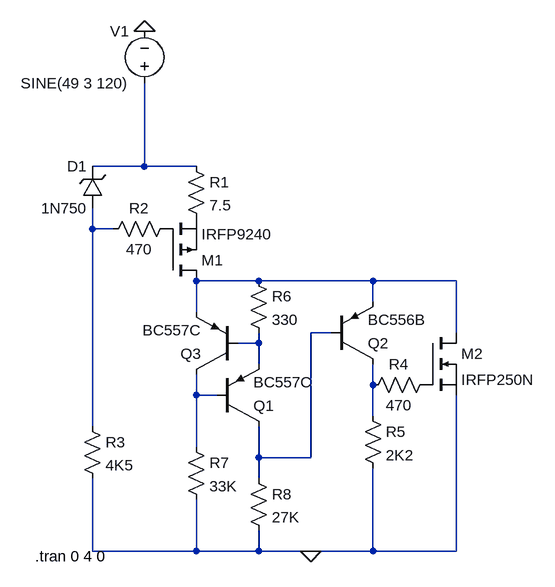
[diagram p0: schematic SALASSHUNTHV.asc]
SALASSHUNTHV.asc, the LTspice schematic file:
Version 4
SHEET 1 1072 680
WIRE 112 -16 112 -144
WIRE 112 -16 32 -16
WIRE 192 -16 112 -16
WIRE 32 80 32 48
WIRE 64 80 32 80
WIRE 288 160 192 160
WIRE 464 160 288 160
WIRE 512 160 464 160
WIRE 592 160 512 160
WIRE 464 192 464 160
WIRE 192 208 192 160
WIRE 400 240 368 240
WIRE 592 240 592 160
WIRE 288 256 288 240
WIRE 288 256 256 256
WIRE 288 288 288 256
WIRE 464 320 464 288
WIRE 192 336 192 304
WIRE 224 336 192 336
WIRE 464 368 464 320
WIRE 32 384 32 80
WIRE 192 416 192 336
WIRE 288 432 288 384
WIRE 368 432 368 240
WIRE 368 432 288 432
WIRE 288 464 288 432
WIRE 32 576 32 464
WIRE 192 576 192 496
WIRE 192 576 32 576
WIRE 288 576 288 544
WIRE 288 576 192 576
WIRE 368 576 288 576
WIRE 464 576 464 448
WIRE 464 576 368 576
WIRE 592 576 592 336
WIRE 592 576 464 576
FLAG 112 -224 0
FLAG 368 576 0
DATAFLAG 512 160 ""
SYMBOL pmos 144 160 M180
SYMATTR InstName M1
SYMATTR Value IRFP9240
SYMBOL res 176 -32 R0
SYMATTR InstName R1
SYMATTR Value 7.5
SYMBOL zener 48 48 R180
WINDOW 0 24 64 Left 2
WINDOW 3 24 0 Left 2
SYMATTR InstName D1
SYMATTR Value 1N750
SYMBOL res 160 64 R90
WINDOW 0 0 56 VBottom 2
WINDOW 3 32 56 VTop 2
SYMATTR InstName R2
SYMATTR Value 470
SYMBOL voltage 112 -128 R180
WINDOW 0 24 96 Left 2
WINDOW 3 24 16 Left 2
WINDOW 123 0 0 Left 2
WINDOW 39 0 0 Left 2
SYMATTR InstName V1
SYMATTR Value SINE(49 3 120)
SYMBOL res 16 368 R0
SYMATTR InstName R3
SYMATTR Value 4K5
SYMBOL nmos 544 240 R0
SYMATTR InstName M2
SYMATTR Value IRFP250N
SYMBOL res 560 304 R90
WINDOW 0 0 56 VBottom 2
WINDOW 3 32 56 VTop 2
SYMATTR InstName R4
SYMATTR Value 470
SYMBOL res 448 352 R0
SYMATTR InstName R5
SYMATTR Value 2K2
SYMBOL pnp 400 288 M180
SYMATTR InstName Q2
SYMATTR Value BC556B
SYMBOL res 272 144 R0
SYMATTR InstName R6
SYMATTR Value 330
SYMATTR SpiceLine tol=5
SYMBOL pnp 224 384 M180
SYMATTR InstName Q1
SYMATTR Value BC557C
SYMBOL pnp 256 304 R180
SYMATTR InstName Q3
SYMATTR Value BC557C
SYMBOL res 176 400 R0
SYMATTR InstName R7
SYMATTR Value 33K
SYMATTR SpiceLine tol=5
SYMBOL res 272 448 R0
SYMATTR InstName R8
SYMATTR Value 27K
SYMATTR SpiceLine tol=5
TEXT -56 584 Left 2 !.tran 0 4 0

The netlist it stands for:
* SALASSHUNTHV.asc
M1 N003 P001 P002 P002 IRFP9240
R1 N001 P002 7.5
D1 N002 N001 1N750
R2 P001 N002 470
V1 N001 0 SINE(49 3 120)
R3 N002 0 4K5
M2 N003 P003 0 0 IRFP250N
R4 P003 N006 470
R5 N006 0 2K2
Q2 N006 N004 N003 0 BC556B
R6 N003 N005 330 tol=5
Q1 N004 N007 N005 0 BC557C
Q3 N007 N005 N003 0 BC557C
R7 N007 0 33K tol=5
R8 N004 0 27K tol=5
.model D D
.lib standard.dio
.model NPN NPN
.model PNP PNP
.lib standard.bjt
.model NMOS NMOS
.model PMOS PMOS
.lib standard.mos
.tran 0 4 0
.backanno
.end